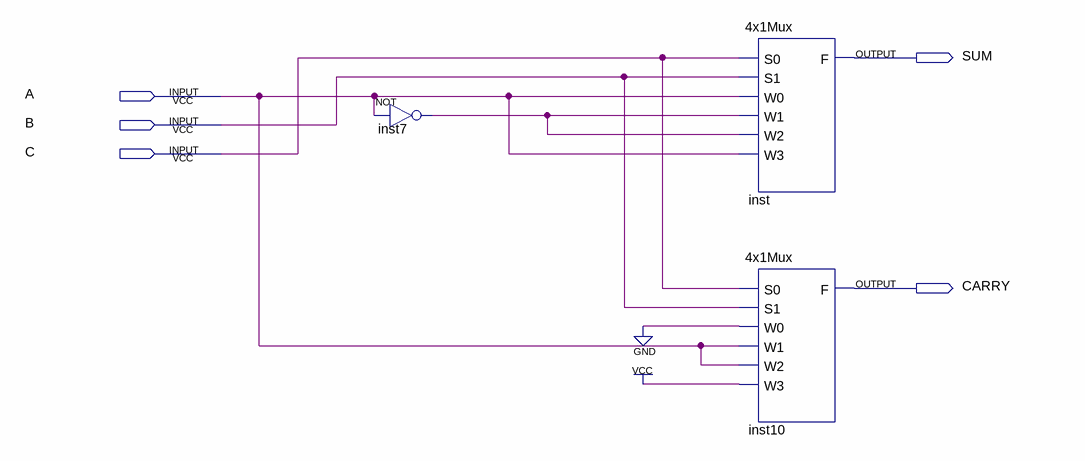
[diagram p0: schematic sheet]
// Quartus schematic Project.bdf as structural Verilog: 3 symbols, 5 pins
module Project (
  input  A,
  input  B,
  input  C,
  output SUM,
  output CARRY
);

  wire inst7_out;

  not inst7 (inst7_out, A);
  \4x1Mux  inst (.S0(C), .S1(B), .W0(A), .W1(inst7_out), .W2(inst7_out), .W3(A), .F(SUM));
  \4x1Mux  inst10 (.S0(C), .S1(B), .W0(1'b0), .W1(A), .W2(A), .W3(1'b1), .F(CARRY));
endmodule
